# EAGLE schematic Temperature Sensor Rev.1 (EAGLE 7.6.0)
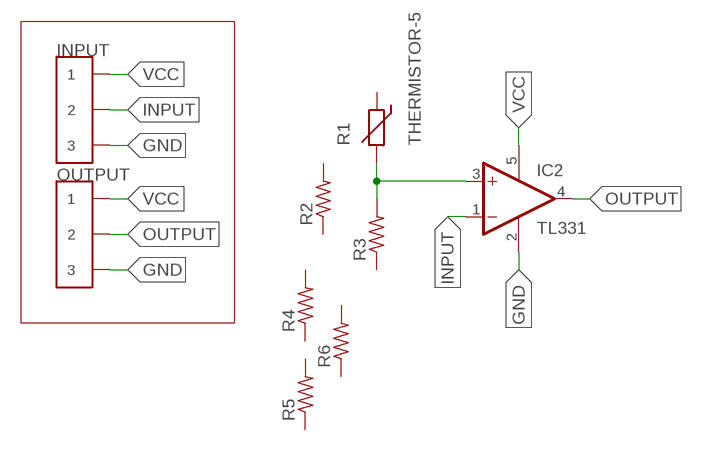
[diagram p0: schematic, sheet 1]

## Parts
IC2  TL331  [DBV-R-PDSO-G5]
INPUT  CONN_3  [CONNECTOR_3]
OUTPUT  CONN_3  [CONNECTOR_3]
R1  THERMISTOR-5  [R-5]
R2  R-US_R0805  [R0805]
R3  R-US_R0805  [R0805]
R4  R-US_R0805  [R0805]
R5  R-US_R0805  [R0805]
R6  R-US_R0805  [R0805]

## Nets
GND: IC2.2(GND) INPUT.5 INPUT.6 OUTPUT.5 OUTPUT.6
INPUT: IC2.1(-IN) INPUT.3 INPUT.4
N$1: IC2.3(+IN) R1.2 R3.2
OUTPUT: IC2.4(OUT) OUTPUT.3 OUTPUT.4
VCC: IC2.5(V+) INPUT.1 INPUT.2 OUTPUT.1 OUTPUT.2
Unconnected: R1.1 R2.1 R2.2 R3.1 R4.1 R4.2 R5.1 R5.2 R6.1 R6.2

## Library data of the parts
IC2 = linear:TL331: SINGLE DIFFERENTIAL COMPARATOR Source: Data sheet <http://www.ti.com/lit/ds/symlink/tl331-q1.pdf>
INPUT OUTPUT = formula electric:CONN_3
R1 = varistor:THERMISTOR: THERMISTOR
R2-R6 = resistor:R-US_: RESISTOR, American symbol